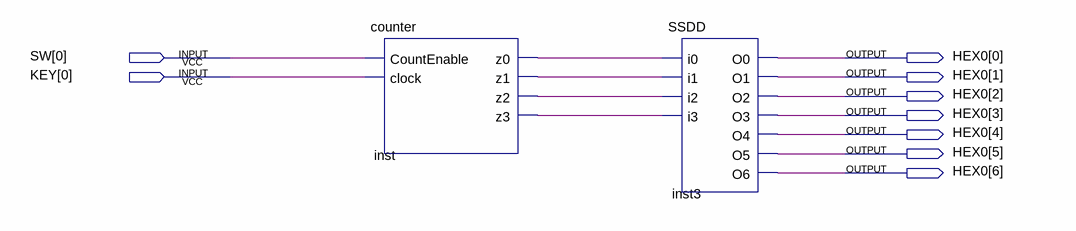
[diagram p0: schematic sheet]
// Quartus schematic LAB.bdf as structural Verilog: 2 symbols, 9 pins
module LAB (
  input  [0:0] SW,
  input  [0:0] KEY,
  output [6:0] HEX0
);

  wire inst_z0, inst_z1, inst_z2, inst_z3;

  counter inst (.CountEnable(SW[0]), .clock(KEY[0]), .z0(inst_z0), .z1(inst_z1), .z2(inst_z2), .z3(inst_z3));
  SSDD inst3 (
    .i0(inst_z0), .i1(inst_z1), .i2(inst_z2), .i3(inst_z3), .O0(HEX0[0]), .O1(HEX0[1]), .O2(HEX0[2]),
    .O3(HEX0[3]), .O4(HEX0[4]), .O5(HEX0[5]), .O6(HEX0[6]));
endmodule
